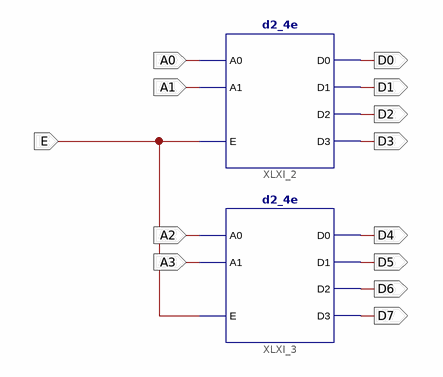
[diagram p0: schematic sheet 1]
// Xilinx ISE schematic decoder4to8.sch (spartan3e) as structural Verilog: 2 symbols, 13 ports
module decoder4to8 (
  input  E,
  input  A0,
  input  A1,
  input  A2,
  input  A3,
  output D0,
  output D1,
  output D2,
  output D3,
  output D4,
  output D5,
  output D6,
  output D7
);

  d2_4e XLXI_2 (.A0(A0), .A1(A1), .E(E), .D0(D0), .D1(D1), .D2(D2), .D3(D3));
  d2_4e XLXI_3 (.A0(A2), .A1(A3), .E(E), .D0(D4), .D1(D5), .D2(D6), .D3(D7));
endmodule
